# EAGLE design halfbridge_panel (EAGLE 9.4.2)
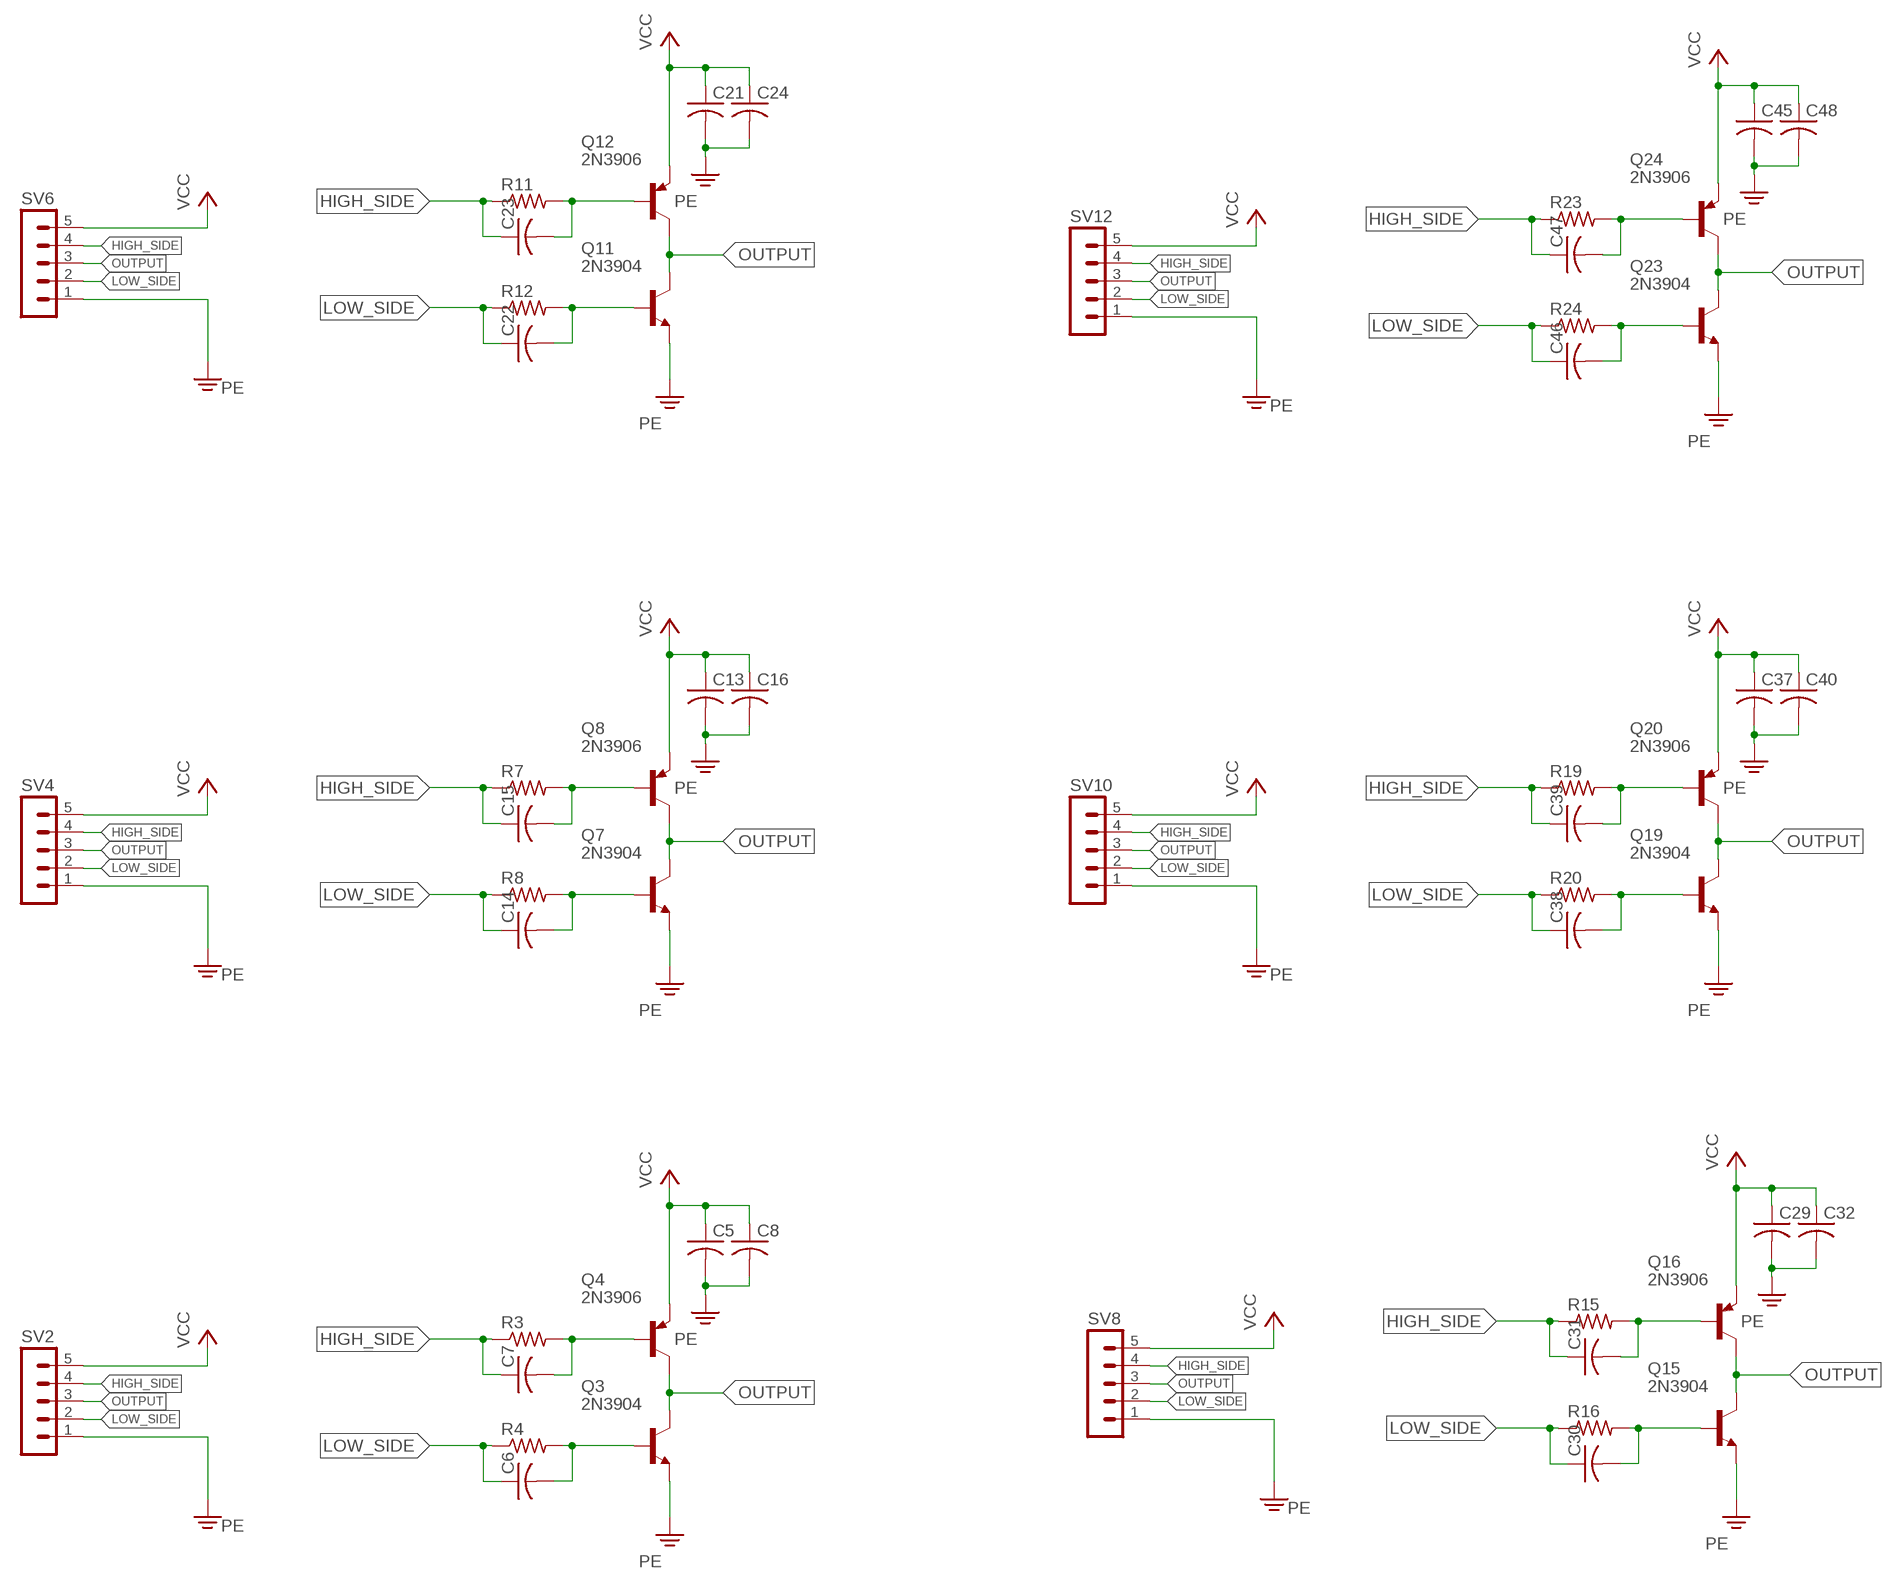
[diagram p0: schematic, sheet 1]

## Parts
C5  C-US050-024X044  [C050-024X044]
C6  C-US050-024X044  [C050-024X044]
C7  C-US050-024X044  [C050-024X044]
C8  C-US050-024X044  [C050-024X044]
C13  C-US050-024X044  [C050-024X044]
C14  C-US050-024X044  [C050-024X044]
C15  C-US050-024X044  [C050-024X044]
C16  C-US050-024X044  [C050-024X044]
C21  C-US050-024X044  [C050-024X044]
C22  C-US050-024X044  [C050-024X044]
C23  C-US050-024X044  [C050-024X044]
C24  C-US050-024X044  [C050-024X044]
C29  C-US050-024X044  [C050-024X044]
C30  C-US050-024X044  [C050-024X044]
C31  C-US050-024X044  [C050-024X044]
C32  C-US050-024X044  [C050-024X044]
C37  C-US050-024X044  [C050-024X044]
C38  C-US050-024X044  [C050-024X044]
C39  C-US050-024X044  [C050-024X044]
C40  C-US050-024X044  [C050-024X044]
C45  C-US050-024X044  [C050-024X044]
C46  C-US050-024X044  [C050-024X044]
C47  C-US050-024X044  [C050-024X044]
C48  C-US050-024X044  [C050-024X044]
Q3  2N3904  [TO-92]
Q4  2N3906  [TO-92]
Q7  2N3904  [TO-92]
Q8  2N3906  [TO-92]
Q11  2N3904  [TO-92]
Q12  2N3906  [TO-92]
Q15  2N3904  [TO-92]
Q16  2N3906  [TO-92]
Q19  2N3904  [TO-92]
Q20  2N3906  [TO-92]
Q23  2N3904  [TO-92]
Q24  2N3906  [TO-92]
R3  R-US_0204/5  [0204/5]
R4  R-US_0204/5  [0204/5]
R7  R-US_0204/5  [0204/5]
R8  R-US_0204/5  [0204/5]
R11  R-US_0204/5  [0204/5]
R12  R-US_0204/5  [0204/5]
R15  R-US_0204/5  [0204/5]
R16  R-US_0204/5  [0204/5]
R19  R-US_0204/5  [0204/5]
R20  R-US_0204/5  [0204/5]
R23  R-US_0204/5  [0204/5]
R24  R-US_0204/5  [0204/5]
SV2  MA05-1  [MA05-1]
SV4  MA05-1  [MA05-1]
SV6  MA05-1  [MA05-1]
SV8  MA05-1  [MA05-1]
SV10  MA05-1  [MA05-1]
SV12  MA05-1  [MA05-1]

## Nets
HIGH_SIDE: C7.1 C15.1 C23.1 C31.1 C39.1 C47.1 R3.1 R7.1 R11.1 R15.1 R19.1 R23.1 SV2.4 SV4.4 SV6.4 SV8.4 SV10.4 SV12.4
LOW_SIDE: C6.1 C14.1 C22.1 C30.1 C38.1 C46.1 R4.1 R8.1 R12.1 R16.1 R20.1 R24.1 SV2.2 SV4.2 SV6.2 SV8.2 SV10.2 SV12.2
N$1: C7.2 Q4.B R3.2
N$2: C6.2 Q3.B R4.2
N$7: C15.2 Q8.B R7.2
N$8: C14.2 Q7.B R8.2
N$11: C23.2 Q12.B R11.2
N$12: C22.2 Q11.B R12.2
N$15: C31.2 Q16.B R15.2
N$16: C30.2 Q15.B R16.2
N$19: C39.2 Q20.B R19.2
N$20: C38.2 Q19.B R20.2
N$23: C47.2 Q24.B R23.2
N$24: C46.2 Q23.B R24.2
OUTPUT: Q3.C Q4.C Q7.C Q8.C Q11.C Q12.C Q15.C Q16.C Q19.C Q20.C Q23.C Q24.C SV2.3 SV4.3 SV6.3 SV8.3 SV10.3 SV12.3
PE: C5.2 C8.2 C13.2 C16.2 C21.2 C24.2 C29.2 C32.2 C37.2 C40.2 C45.2 C48.2 Q3.E Q7.E Q11.E Q15.E Q19.E Q23.E SV2.1 SV4.1 SV6.1 SV8.1 SV10.1 SV12.1
VCC: C5.1 C8.1 C13.1 C16.1 C21.1 C24.1 C29.1 C32.1 C37.1 C40.1 C45.1 C48.1 Q4.E Q8.E Q12.E Q16.E Q20.E Q24.E SV2.5 SV4.5 SV6.5 SV8.5 SV10.5 SV12.5

## Library data of the parts
C5-C8 C13-C16 C21-C24 C29-C32 C37-C40 C45-C48 = rcl:C-US: CAPACITOR, American symbol; SPICEPREFIX: C
Q3 Q7 Q11 Q15 Q19 Q23 = transistors:2N3904
Q4 Q8 Q12 Q16 Q20 Q24 = transistors:2N3906
R3 R4 R7 R8 R11 R12 R15 R16 R19 R20 R23 R24 = rcl:R-US_: RESISTOR, American symbol; SPICEPREFIX: R
SV2 SV4 SV6 SV8 SV10 SV12 = con-lstb:MA05-1: PIN HEADER; OC_FARNELL: unknown; OC_NEWARK: unknown

## Board
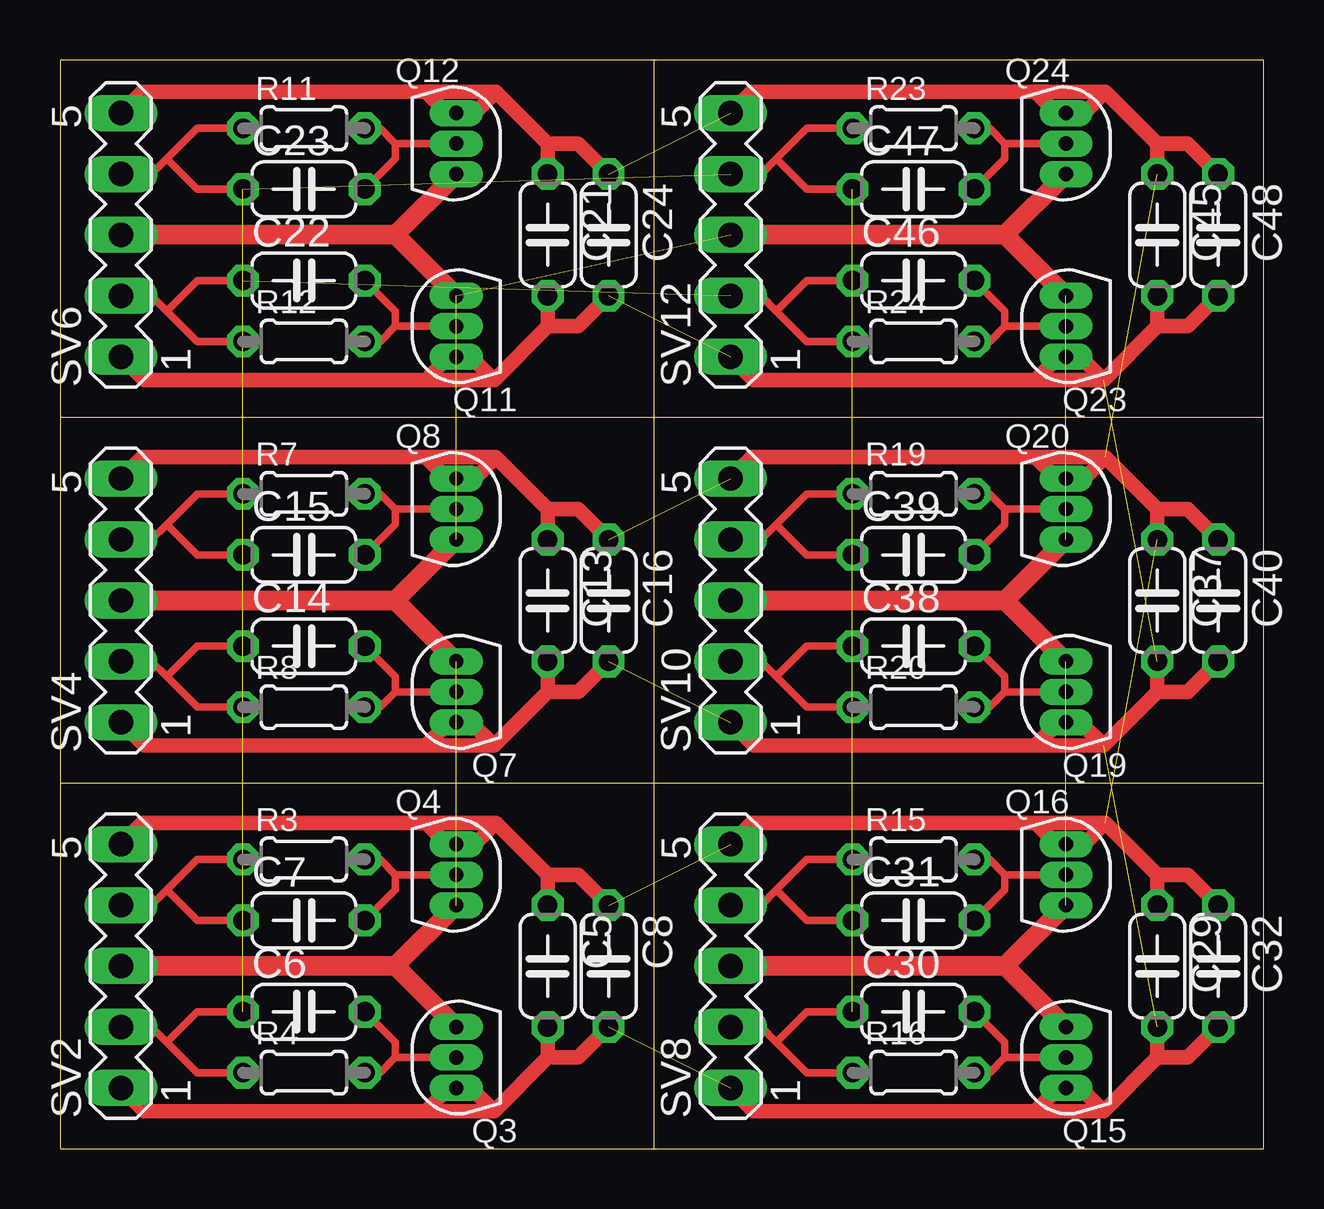
[diagram p1: board, top side]

Size 50.16 x 45.39 mm. Coordinates in mm from the lower left corner, seen from the top.
Outline: 24.74,0 0,0 0,15.24
Outline: 24.74,15.24 0,15.24
Outline: 24.74,30.48 0,30.48
Outline: 0,30.48 0,15.24
Outline: 24.74,45.39 0,45.39 0,30.48
Outline: 24.74,0 50.16,0 50.16,15.24
Outline: 50.16,15.24 24.74,15.24
Outline: 24.74,15.24 24.74,0
Outline: 50.16,15.24 50.16,30.48
Outline: 50.16,30.48 24.74,30.48
Outline: 24.74,30.48 24.74,15.24
Outline: 50.16,30.48 50.16,45.39 24.74,45.39
Outline: 24.74,45.39 24.74,30.48
Copper layers (1*16): Top 0.035mm / dielectric 1.5mm / Bottom 0.035mm
Design rules "default": minimum track width 6mil, minimum drill 0.35mm, track to track 6mil, track to pad 6mil, pad to pad 6mil, via to via 6mil, smd to smd 6mil, copper to edge 40mil, drill to drill 6mil, minimum pad ring 10mil, minimum via ring 8mil, stop-mask expansion 4mil, vias tented up to drill 0mil, thermal gap 10mil

### Footprints (pad centres in the part's own frame; a part is rotated, then mirrored left to right if it is on the bottom)
C050-024X044 = drill 0.813 octagon: 1 -2.54,0; 2 2.54,0
TO-92 = drill 0.6 pad 0.762 long: B 0,0; C 0,-1.27; E 0,1.27
0204/5 = drill 0.813 octagon: 1 -2.54,0; 2 2.54,0
MA05-1 = drill 1.016 long: 1 -5.08,0; 2 -2.54,0; 3 0,0; 4 2.54,0; 5 5.08,0

### Placement (x,y rotation side)
C5  20.32,7.62 270 top
C6  10.16,5.71 0 top
C7  10.16,9.53 0 top
C8  22.86,7.62 270 top
C13  20.32,22.86 270 top
C14  10.16,20.95 0 top
C15  10.16,24.77 0 top
C16  22.86,22.86 270 top
C21  20.32,38.1 270 top
C22  10.16,36.2 0 top
C23  10.16,40 0 top
C24  22.86,38.1 270 top
C29  45.72,7.62 270 top
C30  35.56,5.71 0 top
C31  35.56,9.53 0 top
C32  48.26,7.62 270 top
C37  45.72,22.86 270 top
C38  35.56,20.95 0 top
C39  35.56,24.77 0 top
C40  48.26,22.86 270 top
C45  45.72,38.1 270 top
C46  35.56,36.2 0 top
C47  35.56,40 0 top
C48  48.26,38.1 270 top
Q3  16.51,3.81 180 top
Q4  16.51,11.43 0 top
Q7  16.51,19.05 180 top
Q8  16.51,26.67 0 top
Q11  16.51,34.29 180 top
Q12  16.51,41.91 0 top
Q15  41.91,3.81 180 top
Q16  41.91,11.43 0 top
Q19  41.91,19.05 180 top
Q20  41.91,26.67 0 top
Q23  41.91,34.29 180 top
Q24  41.91,41.91 0 top
R3  10.16,12.06 0 top
R4  10.16,3.18 0 top
R7  10.16,27.3 0 top
R8  10.16,18.41 0 top
R11  10.16,42.55 0 top
R12  10.16,33.66 0 top
R15  35.56,12.06 0 top
R16  35.56,3.18 0 top
R19  35.56,27.3 0 top
R20  35.56,18.41 0 top
R23  35.56,42.55 0 top
R24  35.56,33.66 0 top
SV2  2.54,7.62 90 top
SV4  2.54,22.86 90 top
SV6  2.54,38.1 90 top
SV8  27.94,7.62 90 top
SV10  27.94,22.86 90 top
SV12  27.94,38.1 90 top

### Tracks (layer width: path | path; a pad name or v marks a point on that pad's centre or on a via)
HIGH_SIDE  (5 unrouted)
  Top 0.305: R3.1 5.71,12.06 4.45,10.79 | SV2.4 3.81,10.16 4.45,10.79 | C7.1 5.71,9.53 4.45,10.79 | R7.1 5.71,27.3 4.45,26.03 | SV4.4 3.81,25.4 4.45,26.03 | C15.1 5.71,24.77 4.45,26.03 | R11.1 5.71,42.55 4.45,41.27 | SV6.4 3.81,40.64 4.45,41.27 | C23.1 5.71,40 4.45,41.27 | R15.1 31.12,12.06 29.84,10.79 | SV8.4 29.21,10.16 29.84,10.79 | C31.1 31.12,9.53 29.84,10.79 | R19.1 31.12,27.3 29.84,26.03 | SV10.4 29.21,25.4 29.84,26.03 | C39.1 31.12,24.77 29.84,26.03 | R23.1 31.12,42.55 29.84,41.27 | SV12.4 29.21,40.64 29.84,41.27 | C47.1 31.12,40 29.84,41.27
LOW_SIDE  (5 unrouted)
  Top 0.305: SV2.2 3.81,5.08 4.45,4.45 | 4.45,4.45 5.71,3.18 R4.1 | C6.1 5.71,5.71 4.45,4.45 | SV4.2 3.81,20.32 4.45,19.69 | 4.45,19.69 5.71,18.41 R8.1 | C14.1 5.71,20.95 4.45,19.69 | SV6.2 3.81,35.56 4.45,34.92 | 4.45,34.92 5.71,33.66 R12.1 | C22.1 5.71,36.2 4.45,34.92 | SV8.2 29.21,5.08 29.84,4.45 | 29.84,4.45 31.12,3.18 R16.1 | C30.1 31.12,5.71 29.84,4.45 | SV10.2 29.21,20.32 29.84,19.69 | 29.84,19.69 31.12,18.41 R20.1 | C38.1 31.12,20.95 29.84,19.69 | SV12.2 29.21,35.56 29.84,34.92 | 29.84,34.92 31.12,33.66 R24.1 | C46.1 31.12,36.2 29.84,34.92
N$1
  Top 0.305: 13.97,11.43 Q4.B | C7.2 13.97,10.79 13.97,11.43 | R3.2 13.33,12.06 13.97,11.43
N$2
  Top 0.305: 13.97,3.81 Q3.B | C6.2 13.97,4.45 13.97,3.81 | R4.2 13.33,3.18 13.97,3.81
N$7
  Top 0.305: 13.97,26.67 Q8.B | C15.2 13.97,26.03 13.97,26.67 | R7.2 13.33,27.3 13.97,26.67
N$8
  Top 0.305: 13.97,19.05 Q7.B | C14.2 13.97,19.69 13.97,19.05 | R8.2 13.33,18.41 13.97,19.05
N$11
  Top 0.305: 13.97,41.91 Q12.B | C23.2 13.97,41.27 13.97,41.91 | R11.2 13.33,42.55 13.97,41.91
N$12
  Top 0.305: 13.97,34.29 Q11.B | C22.2 13.97,34.92 13.97,34.29 | R12.2 13.33,33.66 13.97,34.29
N$15
  Top 0.305: 39.37,11.43 Q16.B | C31.2 39.37,10.79 39.37,11.43 | R15.2 38.73,12.06 39.37,11.43
N$16
  Top 0.305: 39.37,3.81 Q15.B | C30.2 39.37,4.45 39.37,3.81 | R16.2 38.73,3.18 39.37,3.81
N$19
  Top 0.305: 39.37,26.67 Q20.B | C39.2 39.37,26.03 39.37,26.67 | R19.2 38.73,27.3 39.37,26.67
N$20
  Top 0.305: 39.37,19.05 Q19.B | C38.2 39.37,19.69 39.37,19.05 | R20.2 38.73,18.41 39.37,19.05
N$23
  Top 0.305: 39.37,41.91 Q24.B | C47.2 39.37,41.27 39.37,41.91 | R23.2 38.73,42.55 39.37,41.91
N$24
  Top 0.305: 39.37,34.29 Q23.B | C46.2 39.37,34.92 39.37,34.29 | R24.2 38.73,33.66 39.37,34.29
OUTPUT  (5 unrouted)
  Top 0.813: SV2.3 13.97,7.62 | Q4.C 13.97,7.62 | Q3.C 13.97,7.62 | SV4.3 13.97,22.86 | Q8.C 13.97,22.86 | Q7.C 13.97,22.86 | SV6.3 13.97,38.1 | Q12.C 13.97,38.1 | Q11.C 13.97,38.1 | SV8.3 39.37,7.62 | Q16.C 39.37,7.62 | Q15.C 39.37,7.62 | SV10.3 39.37,22.86 | Q20.C 39.37,22.86 | Q19.C 39.37,22.86 | SV12.3 39.37,38.1 | Q24.C 39.37,38.1 | Q23.C 39.37,38.1
PE  (5 unrouted)
  Top 0.61: C5.2 20.32,3.81 | SV2.1 3.51,1.58 15.24,1.58 | Q3.E 16.61,2.54 | 20.32,3.81 18.09,1.58 | 18.09,1.58 15.24,1.58 | Q3.E 17.12,2.54 18.09,1.58 | Q3.E 16.2,2.54 15.24,1.58 | C8.2 21.59,3.81 20.32,3.81 | C13.2 20.32,19.05 | SV4.1 3.51,16.81 15.24,16.81 | Q7.E 16.61,17.78 | 20.32,19.05 18.09,16.81 | 18.09,16.81 15.24,16.81 | Q7.E 17.12,17.78 18.09,16.81 | Q7.E 16.2,17.78 15.24,16.81 | C16.2 21.59,19.05 20.32,19.05 | C21.2 20.32,34.29 | SV6.1 3.51,32.05 15.24,32.05 | Q11.E 16.61,33.02 | 20.32,34.29 18.09,32.05 | 18.09,32.05 15.24,32.05 | Q11.E 17.12,33.02 18.09,32.05 | Q11.E 16.2,33.02 15.24,32.05 | C24.2 21.59,34.29 20.32,34.29 | C29.2 45.72,3.81 | SV8.1 28.91,1.58 40.64,1.58 | Q15.E 42.01,2.54 | 45.72,3.81 43.48,1.58 | 43.48,1.58 40.64,1.58 | Q15.E 42.52,2.54 43.48,1.58 | Q15.E 41.61,2.54 40.64,1.58 | C32.2 46.99,3.81 45.72,3.81 | C37.2 45.72,19.05 | SV10.1 28.91,16.81 40.64,16.81 | Q19.E 42.01,17.78 | 45.72,19.05 43.48,16.81 | 43.48,16.81 40.64,16.81 | Q19.E 42.52,17.78 43.48,16.81 | Q19.E 41.61,17.78 40.64,16.81 | C40.2 46.99,19.05 45.72,19.05 | C45.2 45.72,34.29 | SV12.1 28.91,32.05 40.64,32.05 | Q23.E 42.01,33.02 | 45.72,34.29 43.48,32.05 | 43.48,32.05 40.64,32.05 | Q23.E 42.52,33.02 43.48,32.05 | Q23.E 41.61,33.02 40.64,32.05 | C48.2 46.99,34.29 45.72,34.29
VCC  (5 unrouted)
  Top 0.61: 18.16,13.59 20.32,11.43 | 20.32,11.43 C5.1 | SV2.5 3.43,13.59 15.24,13.59 | 15.24,13.59 18.16,13.59 | 15.24,13.59 16.13,12.7 Q4.E 17.27,12.7 18.16,13.59 | C8.1 21.59,11.43 20.32,11.43 | 18.16,28.83 20.32,26.67 | 20.32,26.67 C13.1 | SV4.5 3.43,28.83 15.24,28.83 | 15.24,28.83 18.16,28.83 | 15.24,28.83 16.13,27.94 Q8.E 17.27,27.94 18.16,28.83 | C16.1 21.59,26.67 20.32,26.67 | 18.16,44.07 20.32,41.91 | 20.32,41.91 C21.1 | SV6.5 3.43,44.07 15.24,44.07 | 15.24,44.07 18.16,44.07 | 15.24,44.07 16.13,43.18 Q12.E 17.27,43.18 18.16,44.07 | C24.1 21.59,41.91 20.32,41.91 | 43.56,13.59 45.72,11.43 | 45.72,11.43 C29.1 | SV8.5 28.83,13.59 40.64,13.59 | 40.64,13.59 43.56,13.59 | 40.64,13.59 41.53,12.7 Q16.E 42.67,12.7 43.56,13.59 | C32.1 46.99,11.43 45.72,11.43 | 43.56,28.83 45.72,26.67 | 45.72,26.67 C37.1 | SV10.5 28.83,28.83 40.64,28.83 | 40.64,28.83 43.56,28.83 | 40.64,28.83 41.53,27.94 Q20.E 42.67,27.94 43.56,28.83 | C40.1 46.99,26.67 45.72,26.67 | 43.56,44.07 45.72,41.91 | 45.72,41.91 C45.1 | SV12.5 28.83,44.07 40.64,44.07 | 40.64,44.07 43.56,44.07 | 40.64,44.07 41.53,43.18 Q24.E 42.67,43.18 43.56,44.07 | C48.1 46.99,41.91 45.72,41.91